# Altium schematic sheet timing.SchDoc
size A4; SheetNumber: 5; SheetTotal: 5
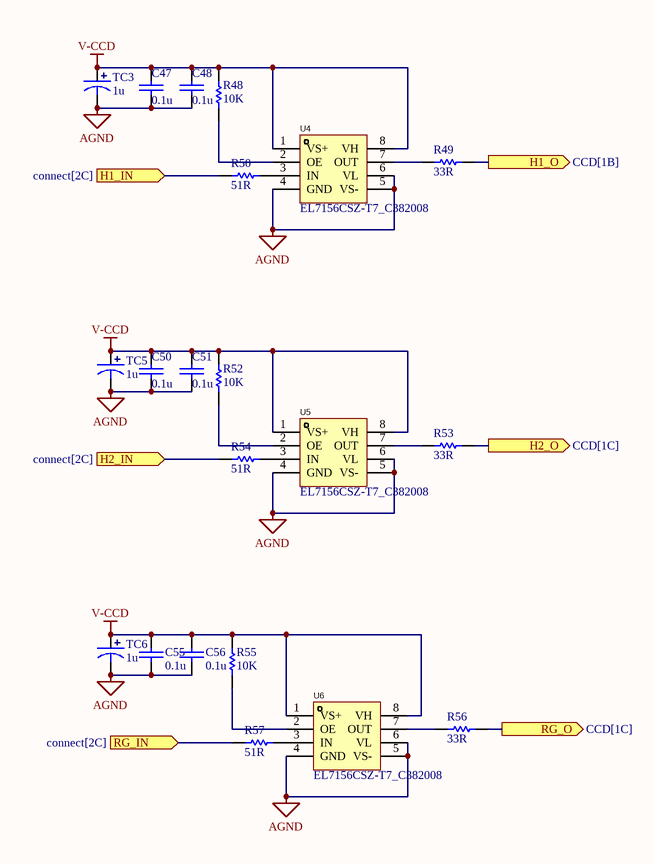
[diagram p0: timing.SchDoc]

## Parts
C47  0.1u  [0603C]
C48  0.1u  [0603C]
C50  0.1u  [0603C]
C51  0.1u  [0603C]
C55  0.1u  [0603C]
C56  0.1u  [0603C]
R48  10K  [0603R]
R49  33R  [0603R]
R50  51R  [0603R]
R52  10K  [0603R]
R53  33R  [0603R]
R54  51R  [0603R]
R55  10K  [0603R]
R56  33R  [0603R]
R57  51R  [0603R]
TC3  1u  [TAJ-A/3216]
TC5  1u  [TAJ-A/3216]
TC6  1u  [TAJ-A/3216]
U4  EL7156CSZ-T7_C382008  [SOIC-8]
U5  EL7156CSZ-T7_C382008  [SOIC-8]
U6  EL7156CSZ-T7_C382008  [SOIC-8]

## Ports
H1_IN (in, see connect[2C]), H1_O (out, see CCD[1B]), H2_IN (in, see connect[2C]), H2_O (out, see CCD[1C]), RG_IN (in, see connect[2C]), RG_O (out, see CCD[1C])

## Nets
AGND: C47.2 C48.2 C50.2 C51.2 C55.2 C56.2 TC3.2 TC5.2 TC6.2 U4.4(GND) U4.5(VS-) U4.6(VL) U5.4(GND) U5.5(VS-) U5.6(VL) U6.4(GND) U6.5(VS-) U6.6(VL)
V-CCD: C47.1 C48.1 C50.1 C51.1 C55.1 C56.1 R48.1 R52.1 R55.1 TC3.1 TC5.1 TC6.1 U4.1(VS+) U4.8(VH) U5.1(VS+) U5.8(VH) U6.1(VS+) U6.8(VH)
H1_IN: R50.2 ; port H1_IN
H1_O: R49.1 ; port H1_O
H2_IN: R54.2 ; port H2_IN
H2_O: R53.1 ; port H2_O
RG_IN: R57.2 ; port RG_IN
RG_O: R56.1 ; port RG_O
NetR48_2: R48.2 U4.2(OE)
NetR49_2: R49.2 U4.7(OUT)
NetR50_1: R50.1 U4.3(IN)
NetR52_2: R52.2 U5.2(OE)
NetR53_2: R53.2 U5.7(OUT)
NetR54_1: R54.1 U5.3(IN)
NetR55_2: R55.2 U6.2(OE)
NetR56_2: R56.2 U6.7(OUT)
NetR57_1: R57.1 U6.3(IN)

## Library data of the parts
C47 C48 C50 C51 C55 C56 = CAP: 无极性电容
R48-R50 R52-R57 = RES: 电阻
TC3 TC5 TC6 = TCAP: 钽电容
U4-U6 = EL7156CSZ-T7: 栅极驱动器; Manufacturer: Intersil(英特矽尔); Add into BOM: yes; Name: EL7156CSZ-T7; Symbol: EL7156CSZ-T7; Device: EL7156CSZ-T7_C382008; LCSC Part Name: EL7156CSZ-T7; Supplier Part: C382008; Manufacturer Part: EL7156CSZ-T7; Supplier Footprint: SOIC-8; JLCPCB Part Class: Extended Part; Datasheet: https://atta.szlcsc.com/upload/public/pdf/source/20190409/C382008_2839965C4C72C039364B6D8C7260FFBC.pdf; Supplier: LCSC; Convert to PCB: yes